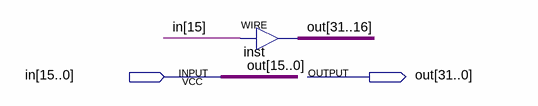
[diagram p0: schematic sheet]
// Quartus schematic SignExtend.bdf as structural Verilog: 1 symbols, 2 pins
module SignExtend (
  input  [15:0] in,
  output [31:0] out
);

  assign out[31:16] = {16{in[15]}};  // WIRE inst

  assign out[15:0] = in;
endmodule
